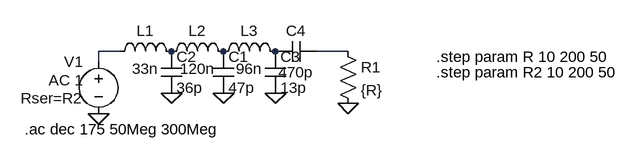
[diagram p0: schematic 125Mhz_LP_filter_calculator.asc]
125Mhz_LP_filter_calculator.asc, the LTspice schematic file:
Version 4
SHEET 1 880 680
WIRE 64 -256 32 -256
WIRE 416 -256 368 -256
WIRE 32 -240 32 -256
FLAG 304 -192 0
FLAG 224 -192 0
FLAG 144 -192 0
FLAG 416 -176 0
FLAG 32 -160 0
SYMBOL ind 48 -240 R270
WINDOW 0 32 56 VTop 2
WINDOW 3 5 56 VBottom 2
SYMATTR InstName L1
SYMATTR Value 33n
SYMATTR SpiceLine Rser=0.75
SYMBOL ind 128 -240 R270
WINDOW 0 32 56 VTop 2
WINDOW 3 5 56 VBottom 2
SYMATTR InstName L2
SYMATTR Value 120n
SYMATTR SpiceLine Rser=0.65
SYMBOL ind 208 -240 R270
WINDOW 0 32 56 VTop 2
WINDOW 3 5 56 VBottom 2
SYMATTR InstName L3
SYMATTR Value 96n
SYMATTR SpiceLine Rser=0.16
SYMBOL cap 208 -256 R0
SYMATTR InstName C1
SYMATTR Value 47p
SYMBOL cap 128 -256 R0
SYMATTR InstName C2
SYMATTR Value 36p
SYMBOL cap 288 -256 R0
SYMATTR InstName C3
SYMATTR Value 13p
SYMBOL cap 368 -272 R90
WINDOW 0 0 32 VBottom 2
WINDOW 3 32 32 VTop 2
SYMATTR InstName C4
SYMATTR Value 470p
SYMBOL res 400 -272 R0
SYMATTR InstName R1
SYMATTR Value {R}
SYMBOL voltage 32 -256 M0
WINDOW 123 24 44 Left 2
WINDOW 39 24 72 Left 2
SYMATTR InstName V1
SYMATTR Value ""
SYMATTR Value2 AC 1
SYMATTR SpiceLine Rser=R2
TEXT -82 -136 Left 2 !.ac dec 175 50Meg 300Meg
TEXT 552 -248 Left 2 !.step param R 10 200 50
TEXT 552 -224 Left 2 !.step param R2 10 200 50

The netlist it stands for:
* 125Mhz_LP_filter_calculator.asc
L1 N001 P001 33n Rser=0.75
L2 P001 P002 120n Rser=0.65
L3 P002 P003 96n Rser=0.16
C1 P002 0 47p
C2 P001 0 36p
C3 P003 0 13p
C4 N002 P003 470p
R1 N002 0 {R}
V1 N001 0 AC 1 Rser=R2
.ac dec 175 50Meg 300Meg
.step param R 10 200 50
.step param R2 10 200 50
.backanno
.end